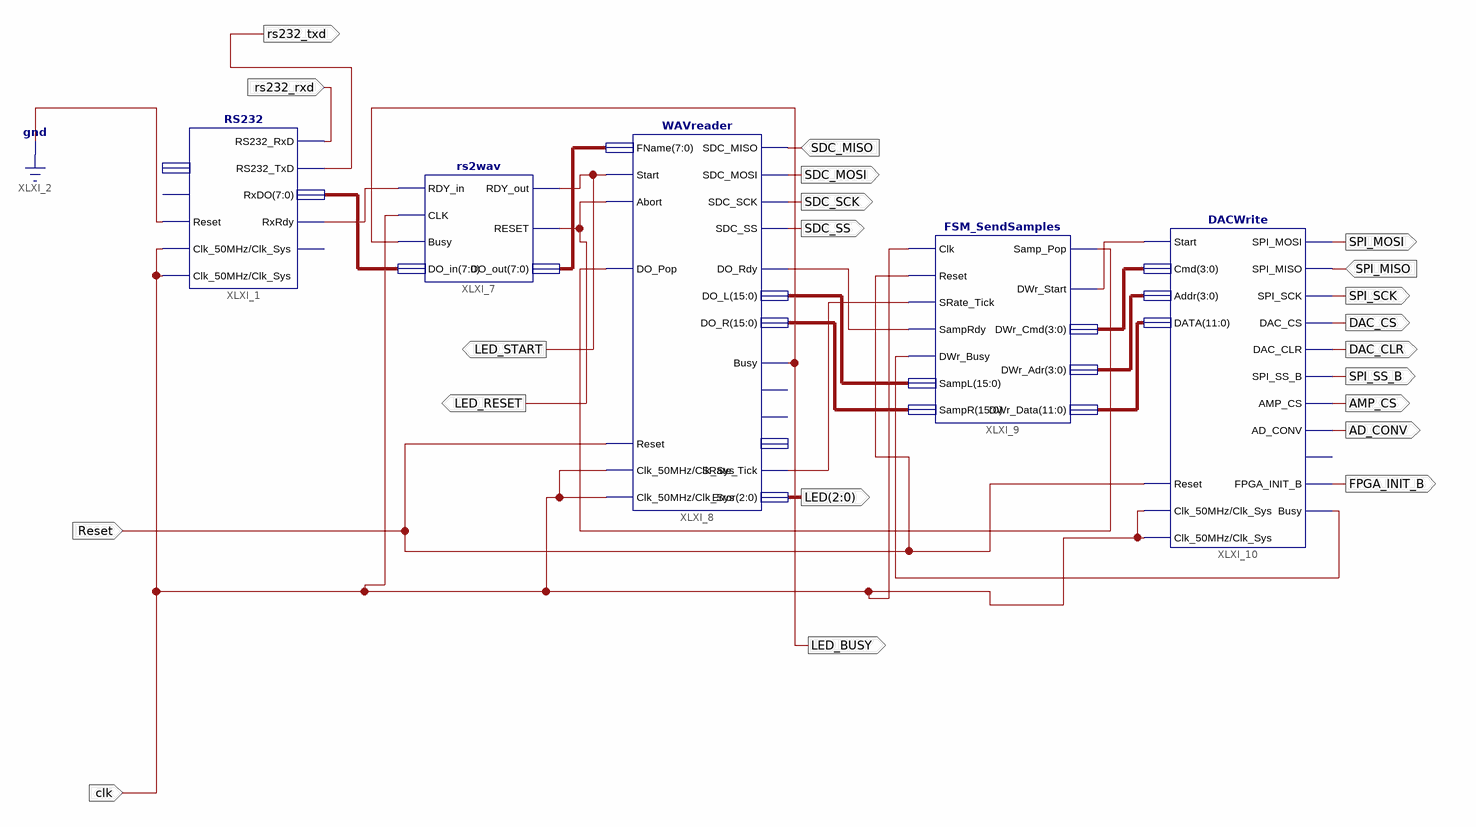
[diagram p0: schematic sheet 1]
// Xilinx ISE schematic rs_test.sch (spartan3e) as structural Verilog: 5 symbols, 21 ports
module rs_test (
  input  clk,
  input  rs232_rxd,
  input  SDC_MISO,
  input  SPI_MISO,
  input  Reset,
  output rs232_txd,
  output LED_START,
  output LED_RESET,
  output SDC_MOSI,
  output SDC_SCK,
  output SDC_SS,
  output LED_BUSY,
  output [2:0] LED,
  output DAC_CLR,
  output DAC_CS,
  output SPI_MOSI,
  output SPI_SCK,
  output SPI_SS_B,
  output AMP_CS,
  output AD_CONV,
  output FPGA_INIT_B
);

  wire XLXN_21, XLXN_29, XLXN_36, XLXN_37, XLXN_41, XLXN_54;
  wire [3:0] XLXN_39, XLXN_40;
  wire [7:0] LEDt, LEDtu;
  wire [11:0] XLXN_38;
  wire [15:0] XLXN_31, XLXN_32;

  RS232 XLXI_1 (
    .Clk_50MHz(clk), .Reset(1'b0), .RS232_RxD(rs232_rxd), .RxRdy(XLXN_21), .RS232_TxD(rs232_txd),
    .RxDO(LEDt), .Clk_Sys(clk));  // open: TxStart, TxDI, TxBusy
  rs2wav XLXI_7 (
    .RDY_in(XLXN_21), .CLK(clk), .Busy(LED_BUSY), .DO_in(LEDt), .RDY_out(LED_START), .RESET(LED_RESET),
    .DO_out(LEDtu));
  WAVreader XLXI_8 (
    .FName(LEDtu), .Start(LED_START), .Abort(LED_RESET), .SDC_MOSI(SDC_MOSI), .SDC_SCK(SDC_SCK),
    .SDC_SS(SDC_SS), .SDC_MISO(SDC_MISO), .DO_Pop(XLXN_37), .SRate_Tick(XLXN_36), .Error(LED), .Reset(Reset),
    .Clk_50MHz(clk), .Clk_Sys(clk), .DO_Rdy(XLXN_29), .DO_L(XLXN_31), .DO_R(XLXN_32), .Busy(LED_BUSY));  // open: FmtMnS, Fmt8n16, FmtSRate
  FSM_SendSamples XLXI_9 (
    .Clk(clk), .Reset(Reset), .SRate_Tick(XLXN_36), .SampRdy(XLXN_29), .DWr_Busy(XLXN_54), .SampL(XLXN_31),
    .SampR(XLXN_32), .Samp_Pop(XLXN_37), .DWr_Start(XLXN_41), .DWr_Cmd(XLXN_40), .DWr_Adr(XLXN_39),
    .DWr_Data(XLXN_38));
  DACWrite XLXI_10 (
    .Reset(Reset), .Start(XLXN_41), .SPI_MISO(SPI_MISO), .Cmd(XLXN_40), .Addr(XLXN_39), .DATA(XLXN_38),
    .DAC_CLR(DAC_CLR), .DAC_CS(DAC_CS), .SPI_MOSI(SPI_MOSI), .SPI_SCK(SPI_SCK), .SPI_SS_B(SPI_SS_B),
    .AMP_CS(AMP_CS), .AD_CONV(AD_CONV), .FPGA_INIT_B(FPGA_INIT_B), .Busy(XLXN_54), .Clk_50MHz(clk),
    .Clk_Sys(clk));  // open: SF_CE0
endmodule
